# Altium schematic sheet SCH-5-ESC3.SchDoc
size Letter
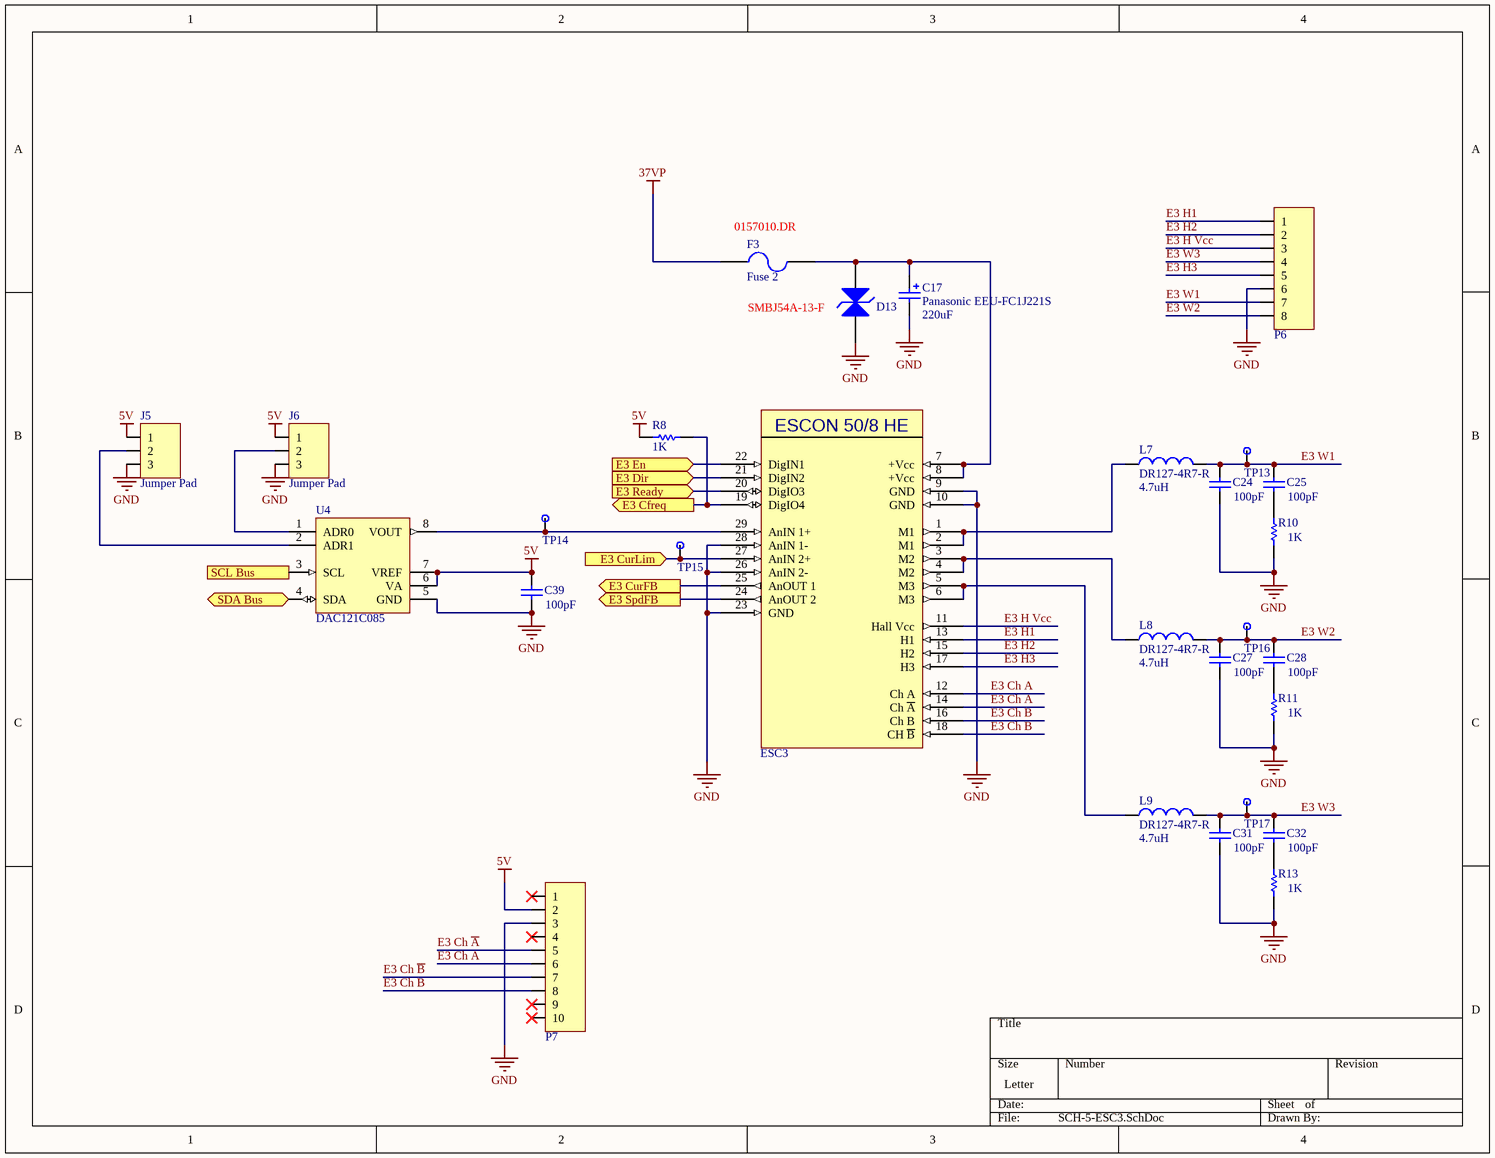
[diagram p0: SCH-5-ESC3.SchDoc]

## Parts
C17  Panasonic EEU-FC1J221S  value 220uF  [Panasonic EEU-FC1J221S]
C24  value 100pF  [C1206]  (hidden comment: Cap Semi)
C25  value 100pF  [C1206]  (hidden comment: Cap Semi)
C27  value 100pF  [C1206]  (hidden comment: Cap Semi)
C28  value 100pF  [C1206]  (hidden comment: Cap Semi)
C31  value 100pF  [C1206]  (hidden comment: Cap Semi)
C32  value 100pF  [C1206]  (hidden comment: Cap Semi)
C39  value 100pF  [C1206]  (hidden comment: Cap Semi)
D13  TVS_DIODE  [SMBJ54A-13-F]  (value not drawn)
ESC3  ESCON 50/8 HE  [ESCON 50/8 HE]  (value not drawn)
F3  Fuse 2  [0157010.DR]
J5  Jumper Pad  [3 Pad TH]
J6  Jumper Pad  [3 Pad TH]
L7  DR127-4R7-R  value 4.7uH  [DR127-4R7-R]
L8  DR127-4R7-R  value 4.7uH  [DR127-4R7-R]
L9  DR127-4R7-R  value 4.7uH  [DR127-4R7-R]
P6  Mini-Fit Jr 8 Pos  [Molex Mini-Fit Jr 0039281083]  (value not drawn)
P7  Header_10_Pos_Ribbon Male  [3M_2510-6002UB]  (value not drawn)
R8  value 1K  [RESC1608X06N_0603]  (hidden comment: Res1)
R10  value 1K  [RESC1608X06N_0603]  (hidden comment: Res1)
R11  value 1K  [RESC1608X06N_0603]  (hidden comment: Res1)
R13  value 1K  [RESC1608X06N_0603]  (hidden comment: Res1)
TP13  TestPt  [50_MIL_PAD]  (value not drawn)
TP14  TestPt  [50_MIL_PAD]  (value not drawn)
TP15  TestPt  [50_MIL_PAD]  (value not drawn)
TP16  TestPt  [50_MIL_PAD]  (value not drawn)
TP17  TestPt  [50_MIL_PAD]  (value not drawn)
U4  DAC121C085  [MUA08A_L]

## Ports
E3 Cfreq (out), E3 CurFB (out), E3 CurLim (in), E3 Dir (in), E3 En (in), E3 Ready (in), E3 SpdFB (out), SCL Bus (in), SDA Bus (bidir)

## Nets
5V: C39.2 J5.1 J6.1 P7.2 R8.2 U4.6(VA) U4.7(VREF)
37VP: F3.1
GND: C17.2 C24.1 C27.1 C31.1 C39.1 D13.1(A) ESC3.9(GND) ESC3.10(GND) ESC3.23(GND) ESC3.26(AnIN_2-) ESC3.28(AnIN_1-) J5.3 J6.3 P6.6 P7.3 R10.1 R11.1 R13.1 U4.5(GND)
E3 Cfreq: ESC3.19(DigIO4) R8.1 ; port E3 Cfreq
E3 Ch A: ESC3.12(Ch_A) P7.6
E3 Ch ~{A}: ESC3.14(Ch_~{A}) P7.5
E3 Ch B: ESC3.16(Ch_B) P7.8
E3 Ch ~{B}: ESC3.18(CH_~{B}) P7.7
E3 CurFB: ESC3.25(AnOUT_1) ; port E3 CurFB
E3 CurLim: ESC3.27(AnIN_2+) TP15.1 ; port E3 CurLim
E3 Dir: ESC3.21(DigIN2) ; port E3 Dir
E3 En: ESC3.22(DigIN1) ; port E3 En
E3 H1: ESC3.13(H1) P6.1
E3 H2: ESC3.15(H2) P6.2
E3 H3: ESC3.17(H3) P6.5
E3 H Vcc: ESC3.11(Hall_Vcc) P6.3
E3 Ready: ESC3.20(DigIO3) ; port E3 Ready
E3 SpdFB: ESC3.24(AnOUT_2) ; port E3 SpdFB
E3 W1: C24.2 C25.2 L7.2 P6.7 TP13.1
E3 W2: C27.2 C28.2 L8.2 P6.8 TP16.1
E3 W3: C31.2 C32.2 L9.2 P6.4 TP17.1
SCL Bus: U4.3(SCL) ; port SCL Bus
SDA Bus: U4.4(SDA) ; port SDA Bus
NetC17_1: C17.1 D13.2(K) ESC3.7(+Vcc) ESC3.8(+Vcc) F3.2
NetC25_1: C25.1 R10.2
NetC28_1: C28.1 R11.2
NetC32_1: C32.1 R13.2
NetESC3_1: ESC3.1(M1) ESC3.2(M1) L7.1
NetESC3_3: ESC3.3(M2) ESC3.4(M2) L8.1
NetESC3_5: ESC3.5(M3) ESC3.6(M3) L9.1
NetESC3_29: ESC3.29(AnIN_1+) TP14.1 U4.8(VOUT)
NetJ5_2: J5.2 U4.2(ADR1)
NetJ6_2: J6.2 U4.1(ADR0)

Not connected (* = marked no-connect by the designer): P7 1* 4* 9* 10*

## Notes on the sheet
- (near F3) 0157010.DR
- SMBJ54A-13-F

## Library data of the parts
C17 = Panasonic EEU-FC1J221S: Polarized Capacitor (Radial)
C24 C25 C27 C28 C31 C32 C39 = Cap Semi: Capacitor (Semiconductor SIM Model); Published: 8-Jun-2000; LatestRevisionDate: 29-May-2009; LatestRevisionNote: IPC-7351 Footprint Added.; PackageReference: C1206; Publisher: Altium Limited; PackageDescription: Chip Capacitor
D13 = TVS_DIODE: TVS Diode; Published: 8-Jun-2000; LatestRevisionDate: 17-Jul-2002; LatestRevisionNote: Re-released for DXP Platform.; PackageVersion: Sep-1996; PackageReference: SMC; Publisher: Altium Limited; PackageDescription: DO-214-AB/SMC; 2 C-Bend Leads; Body 7.9 x 5.9 mm, inc. leads (LxW); Code_JEDEC: DO-214-AB
ESC3 = ESCON 50/8 HE: ESCON Module 50/8 HE Servocontroller
F3 = Fuse 2: Fuse; Published: 8-Jun-2000; LatestRevisionDate: 17-Jul-2002; LatestRevisionNote: Re-released for DXP Platform.; PackageReference: PIN-W2/E2.8; Publisher: Altium Limited; PackageDescription: Thru-Hole; 2 Leads
J5 J6 = 3 Pad Jump Sel
L7-L9 = DR127-4R7-R: 4.7µH Shielded Wirewound Inductor 8.25A 9.17mOhm Nonstandard; Code_IEC: 1005; Published: 8-Jun-2000; LatestRevisionDate: 29-May-2009; LatestRevisionNote: IPC-7351 Footprint Added.; PackageReference: 0402-A; Publisher: Altium Limited; PackageDescription: Chip Inductor; Code_JEITA: 0402
P6 = Molex Mini-Fit Jr 8pos Vert
P7 = Header_10_Pos_Ribbon Male: 3M_2510-6002UB
R8 R10 R11 R13 = Res1: Resistor; Published: 8-Jun-2000; LatestRevisionDate: 17-Jul-2002; LatestRevisionNote: Re-released for DXP Platform.; PackageReference: AXIAL-0.3; Publisher: Altium Limited; PackageDescription: Axial Device, Thru-Hole; 2 Leads; 0.3 in Pin Spacing
U4 = DAC121C085: 12-Bit Micro Power Digital-to-Analog Converter with an I2C-Compatible Interface and External Reference, 8-pin Mini SOIC, Pb-Free; Manufacturer: National Semiconductor; PackageTopMarking: XTT*X90C; PowerWise: Y; CompType: D/A Converter; ComponentLink3URL: http://www.national.com/packaging/folders/mua08a.html; ComponentLink2URL: http://www.national.com/pf/DA/DAC121C085.html; Code_JEDEC: MO-187-AA; ComponentLink1URL: http://www.national.com/ds/DA/DAC121C085.pdf; RoHS: Y; PackageVersion: revF, Apr-2008; PackageDescription: MINI SOIC, .118 x .118 x .034in, 8 Lead, .0256in Pitch; PackageReference: MUA08A; PinCount: 8; DatasheetVersion: Mar-2008; ComponentLink1Description: DAC121C085 Datasheet; ComponentLink2Description: DAC121C085 Web Page; ComponentLink3Description: MUA08A Package Page; RevisionNote: Component URLs added